# Altium schematic sheet PowerV1.2.SchDoc
size A4
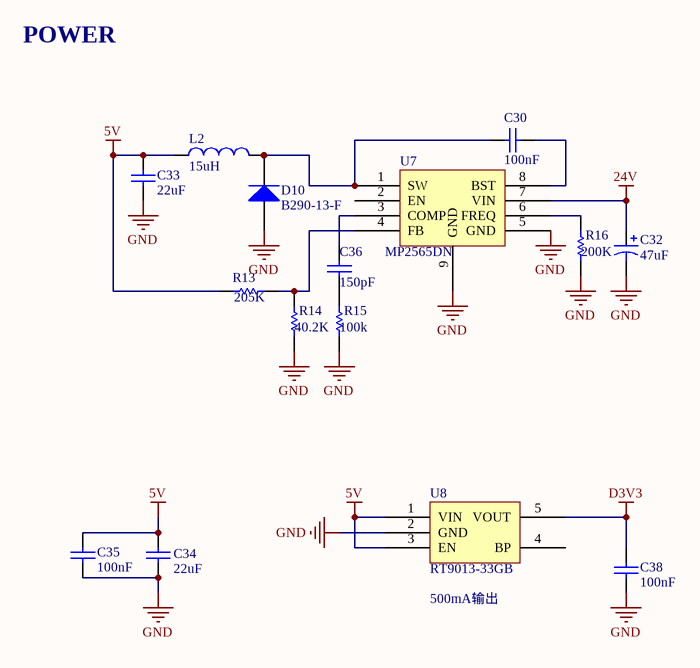
[diagram p0: PowerV1.2.SchDoc]

## Parts
C30  100nF  [0402]
C32  47uF  [cap_pol_8*10.2]
C33  22uF  [0805]
C34  22uF  [1206]
C35  100nF  [0402]
C36  150pF  [0402]
C38  100nF  [0402]
D10  B290-13-F  [B290]
L2  15uH  [10*10Inductor]
R13  205K  [0402]
R14  40.2K  [0402]
R15  100k  [0402]
R16  200K  [0402]
U7  MP2565DN  [MP2565DN]
U8  RT9013-33GB  [SOT-23-5]

## Nets
5V: C33.2 C34.2 C35.2 L2.1 R13.2 U8.1(VIN) U8.3(EN)
24V: C32.1 U7.7(VIN)
D3V3: C38.2 U8.5(VOUT)
GND: C32.2 C33.1 C34.1 C35.1 C38.1 D10.1(A) R14.1 R15.1 R16.1 U7.5(GND) U7.9(GND) U8.2(GND)
NetC30_1: C30.1 U7.8(BST)
NetC30_2: C30.2 D10.2(K) L2.2 U7.1(SW)
NetC36_1: C36.1 U7.3(COMP)
NetC36_2: C36.2 R15.2
NetR13_1: R13.1 R14.2 U7.4(FB)
NetR16_2: R16.2 U7.6(FREQ)

Not connected (* = marked no-connect by the designer): U7 2(EN); U8 4(BP)

## Notes on the sheet
- POWER
- (near U8) 500mA输出

## Library data of the parts
C30 C36 = Cap: Capacitor; Value: 100pF; Published: 8-Jun-2000; LatestRevisionDate: 17-Jul-2002; LatestRevisionNote: Re-released for DXP Platform.; PackageReference: RAD-0.3; Publisher: Altium Limited; PackageDescription: Radial Cap, Thru-Hole; 2 Leads; 0.3 in Pin Spacing
C32 = Cap Pol1: Polarized Capacitor (Radial); Value: 100pF; Published: 8-Jun-2000; LatestRevisionDate: 17-Jul-2002; LatestRevisionNote: Re-released for DXP Platform.; PackageReference: RB7.6-15; Publisher: Altium Limited; PackageDescription: Polarized Capacitor (Radial); 2 Leads
C33 = Cap: Capacitor,50V; Value: 100pF; Published: 8-Jun-2000; LatestRevisionDate: 17-Jul-2002; LatestRevisionNote: Re-released for DXP Platform.; PackageReference: RAD-0.3; Publisher: Altium Limited; PackageDescription: Radial Cap, Thru-Hole; 2 Leads; 0.3 in Pin Spacing
C34 = Cap: Capacitor; Published: 8-Jun-2000; LatestRevisionDate: 17-Jul-2002; LatestRevisionNote: Re-released for DXP Platform.; PackageReference: RAD-0.3; Publisher: Altium Limited; PackageDescription: Radial Cap, Thru-Hole; 2 Leads; 0.3 in Pin Spacing; Value: 22uF
C35 = Cap: Capacitor,100V; Published: 8-Jun-2000; LatestRevisionDate: 17-Jul-2002; LatestRevisionNote: Re-released for DXP Platform.; PackageReference: RAD-0.3; Publisher: Altium Limited; PackageDescription: Radial Cap, Thru-Hole; 2 Leads; 0.3 in Pin Spacing; Value: 100nF
C38 = Cap: Capacitor 3V3; Value: 100pF; Published: 8-Jun-2000; LatestRevisionDate: 17-Jul-2002; LatestRevisionNote: Re-released for DXP Platform.; PackageReference: RAD-0.3; Publisher: Altium Limited; PackageDescription: Radial Cap, Thru-Hole; 2 Leads; 0.3 in Pin Spacing
D10 = Diode: Default Diode; Published: 8-Jun-2000; LatestRevisionDate: 17-Jul-2002; LatestRevisionNote: Re-released for DXP Platform.; PackageVersion: Sep-1996; PackageReference: SMC; Publisher: Altium Limited; PackageDescription: DO-214-AB/SMC; 2 C-Bend Leads; Body 7.9 x 5.9 mm, inc. leads (LxW); Code_JEDEC: DO-214-AB
L2 = Inductor: Inductor, 1A; Code_IEC: 1005; Published: 8-Jun-2000; LatestRevisionDate: 29-May-2009; LatestRevisionNote: IPC-7351 Footprint Added.; PackageReference: 0402-A; Publisher: Altium Limited; PackageDescription: Chip Inductor; Code_JEITA: 0402; Value: 15uH
R13 = Res1: Resistor; Value: 210K; Published: 8-Jun-2000; LatestRevisionDate: 17-Jul-2002; LatestRevisionNote: Re-released for DXP Platform.; PackageReference: AXIAL-0.3; Publisher: Altium Limited
R14 R16 = Res1: Resistor; Published: 8-Jun-2000; LatestRevisionDate: 17-Jul-2002; LatestRevisionNote: Re-released for DXP Platform.; PackageReference: AXIAL-0.3; Publisher: Altium Limited
  R14: Value: 40.2K
  R16: Value: 200K
R15 = Res1: Resistor; Value: 47.5K; Published: 8-Jun-2000; LatestRevisionDate: 17-Jul-2002; LatestRevisionNote: Re-released for DXP Platform.; PackageReference: AXIAL-0.3; Publisher: Altium Limited
U8 = RT9193